# EAGLE design Breadboard Power (EAGLE 7.2.0)
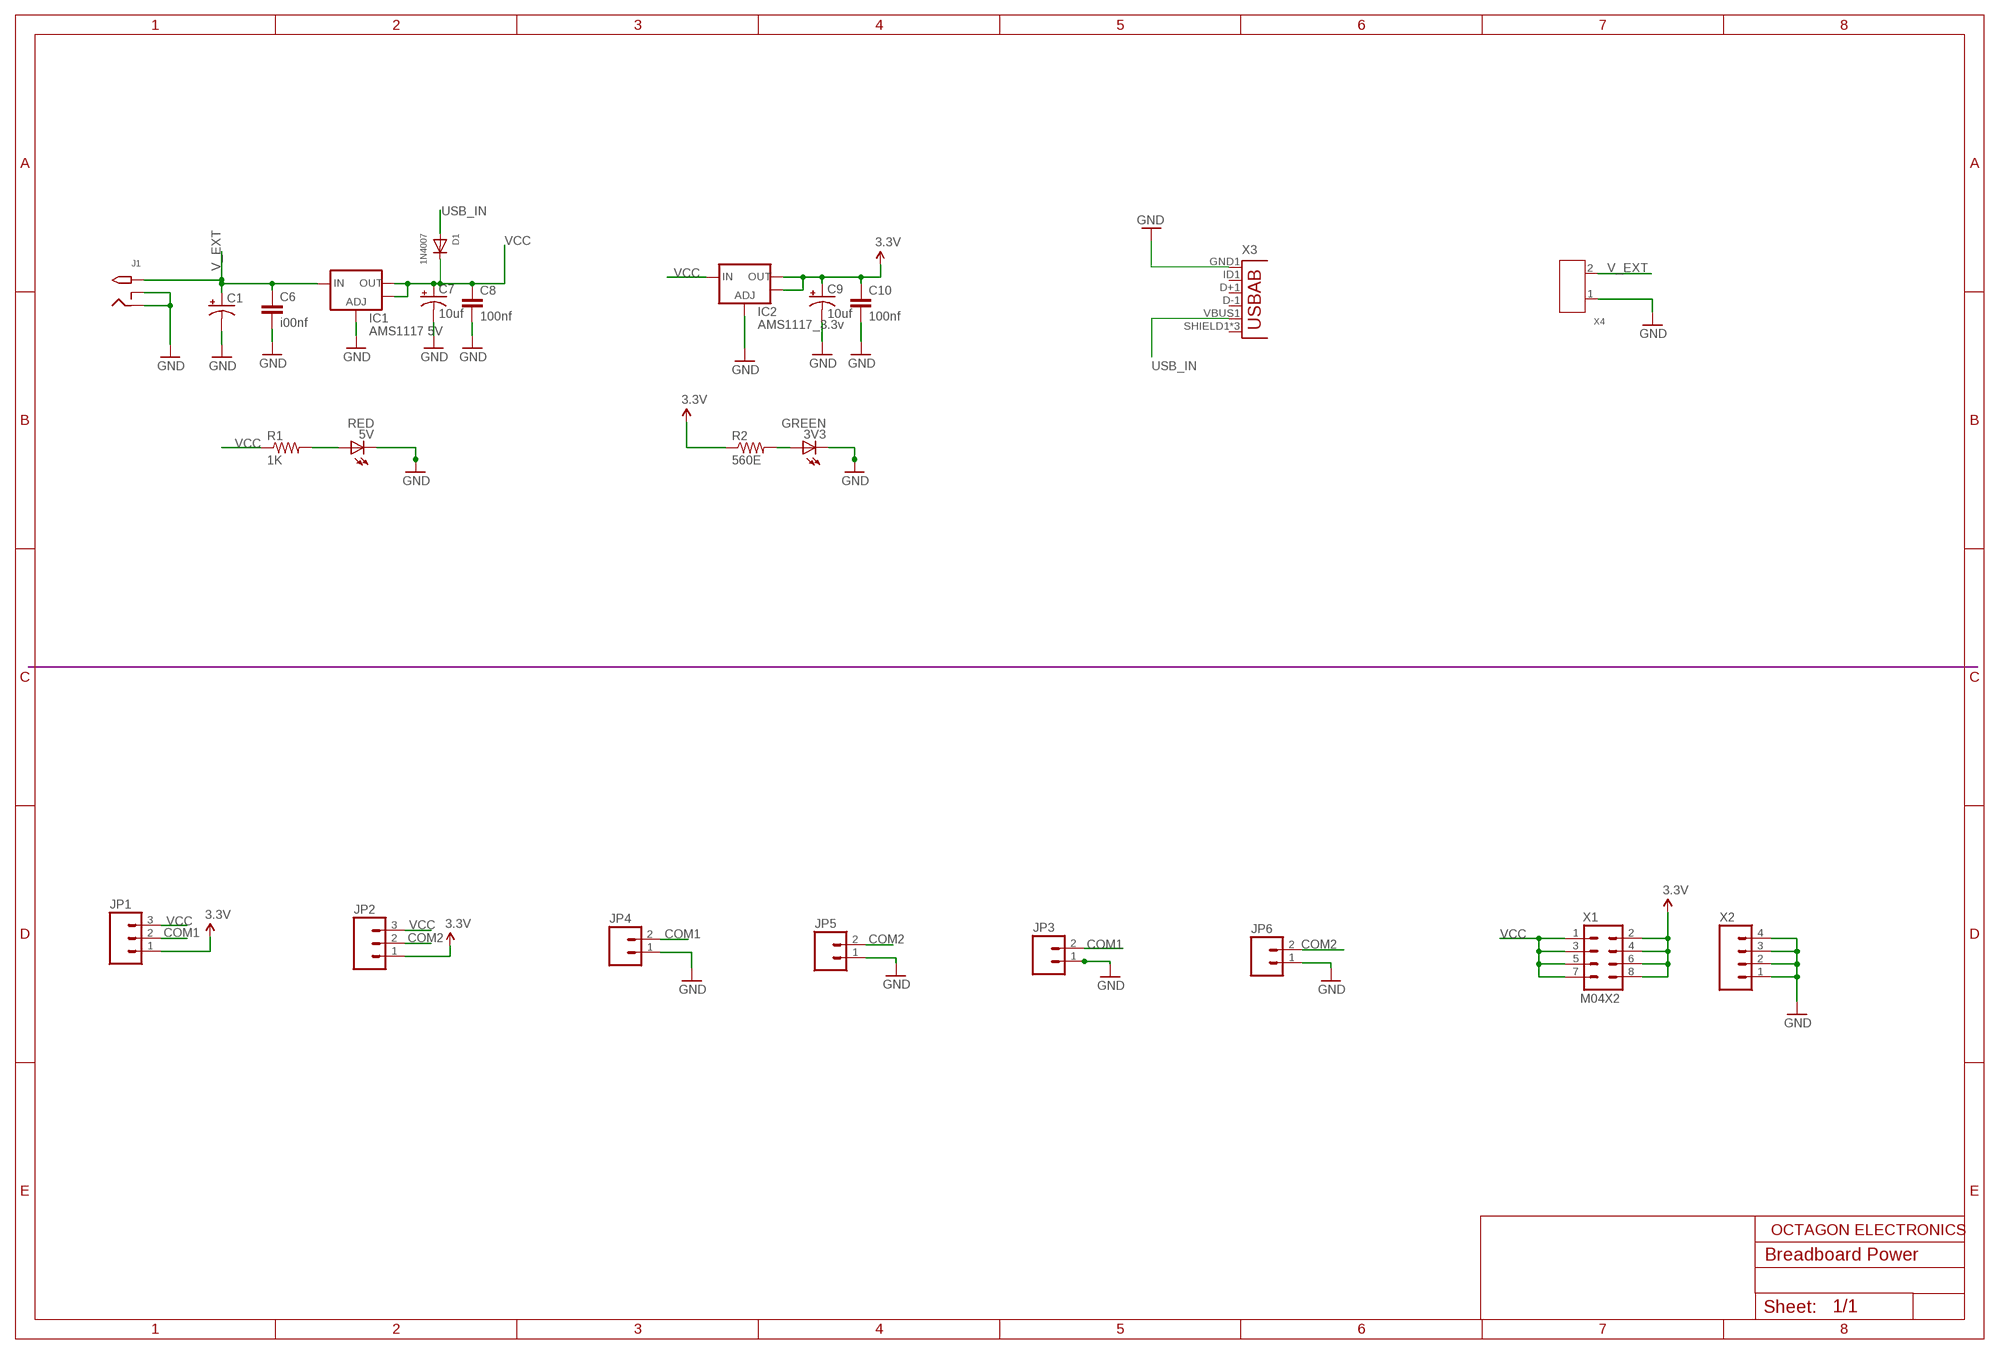
[diagram p0: schematic, sheet 1]

## Parts
3V3  GREEN  LED0603  [LED-0603]
5V  RED  LED0603  [LED-0603]
C1  CAPACITOR_POLARIZEDC  [PANASONIC_C]
C6  i00nf  CAPACITOR-NONPOLARIZEDSMD  [C0603]
C7  10uf  CAPACITOR_POLARIZED1206  [EIA3216]
C8  100nf  CAPACITOR-NONPOLARIZEDSMD  [C0603]
C9  10uf  CAPACITOR_POLARIZED1206  [EIA3216]
C10  100nf  CAPACITOR-NONPOLARIZEDSMD  [C0603]
D1  1N4007  DIODESMA  [SMADIODE]
IC1  AMS1117 5V  V_REG_LM1117SOT223  [SOT223]
IC2  AMS1117_3.3v  V_REG_LM1117SOT223  [SOT223]
J1  2.1MMJACKTHM  [PJ-102A]
JP1  M03PTH  [1X03]
JP2  M03PTH  [1X03]
JP3  M02PTH  [1X02]
JP4  M02PTH  [1X02]
JP5  M02PTH  [1X02]
JP6  M02PTH  [1X02]
R1  1K  R-US_R0603  [R0603]
R2  560E  R-US_R0603  [R0603]
X1  M04X2  [2X4]
X2  M04PTH  [1X04]
X3  USB-ABCONN-11794  [USB-AB-MICRO-SMD_V03]
X4  SCREW-TERMINAL-GREEN(2P-5.0)  [H2-5.0-10.5X8.0MM]

## Nets
3.3V: C9.A(+) C10.1 IC2.2(OUT) IC2.4(OUT) JP1.1 JP2.1 R2.1 X1.2 X1.4 X1.6 X1.8
COM1: JP1.2 JP3.2 JP4.2
COM2: JP2.2 JP5.2 JP6.2
GND: 3V3.C 5V.C C1.- C6.2 C7.C(-) C8.2 C9.C(-) C10.2 IC1.1(ADJ) IC2.1(ADJ) J1.RING J1.RING_SW JP3.1 JP4.1 JP5.1 JP6.1 X2.1 X2.2 X2.3 X2.4 X3.GND1(GND) X4.1
N$1: 5V.A R1.2
N$5: 3V3.A R2.2
USB_IN: D1.A X3.VBUS1(VBUS)
V_EXT: C1.+ C6.1 IC1.3(IN) J1.TIP X4.2
VCC: C7.A(+) C8.1 D1.C IC1.2(OUT) IC1.4(OUT) IC2.3(IN) JP1.3 JP2.3 R1.1 X1.1 X1.3 X1.5 X1.7
Unconnected: X3.D+1(D+) X3.D-1(D-) X3.ID1(USBID) X3.SHIELD1(SHIELD) X3.SHIELD2(SHIELD) X3.SHIELD3(SHIELD)

## Notes on the sheet
- OCTAGON ELECTRONICS

## Library data of the parts
3V3 5V = Entesla_Kanni:LED: LEDs Standard schematic elements and footprints for 5mm, 3mm, 1206, and 0603 sized LEDs. 5mm - Spark Fun Electronics SKU : COM-00529 (and others)
C1 C7 C9 = Entesla_Kanni:CAPACITOR_POLARIZED: Capacitor Polarized These are commonly used SMD and PTH capacitors. Verify the external diameter of the through hole, as it may vary with manufacturer.
C6 C8 C10 = Entesla_Kanni:CAPACITOR-NONPOLARIZED: CAPACITOR, European symbol,Non Polarized Capacitors
D1 = usb:DIODE: Diode SMADIODE - SMA Surface Mount Package 20V 1A Schottky Diode Digikey: 641-1014-6-ND DO-1N4148 - Through Hole Small Current Diode SOD-123 20V 1 A (.5mV Vf) Schottky Diode - Digikey: MBRX120TPMSCT-ND SOD-323 10V 570mA (.38mV Vf, 3ns) Schottky Diode - Digikey: ZLLS410CT-ND SOD-523 30V 30mA Schottky Diode (RB751S-40TE61) - Digikey: RB751S-40TE61CT-ND SOT23-R/W - SOT23 Package (R = Solder Paste/Reflow Ovens, W = Hand-Soldering) BAT54Film 40V 300mA - Digikey: 497-7162-1-ND
IC1 IC2 = SparkFun-PowerIC:V_REG_LM1117: Voltage Regulator LM1117 Standard adjustable voltage regulator but in SMD form. Spark Fun Electronics SKU : COM-00595; PROD_ID: VREG-08170
J1 = adafruit:2.1MMJACK: 2.1mm x 5.5mm THM DC jack with internal switch. Digikey part #PJ-102A, 4UCON part #05537 2.1mm x 5.5mm SMT DC jack with internal switch. Digikey part #PJ-002A-SMT, 4UCON part #03267 By microbuilder.eu & adafruit.com
JP1 JP2 = Entesla-lib-Aug2010:M03: Header 3 Standard 3-pin 0.1" header. Use with straight break away headers (SKU : PRT-00116), right angle break away headers (PRT-00553), swiss pins (PRT-00743), machine pins (PRT-00117), and female headers (PRT-00115). Molex polarized connector foot print use with SKU : PRT-08232 with associated crimp pins and housings.
JP3-JP6 = led_0603:M02: Header 2 Standard 2-pin 0.1" header. Use with straight break away headers (SKU : PRT-00116), right angle break away headers (PRT-00553), swiss pins (PRT-00743), machine pins (PRT-00117), and female headers (PRT-00115). Molex polarized connector foot print use with SKU : PRT-08233 with associated crimp pins and housings.
R1 R2 = Entesla_Kanni:R-US_: RESISTOR, American symbol
X1 = SparkFun-Connectors:M04X2: .1" header, two rows of four.
X2 = usb:M04: Header 4 Standard 4-pin 0.1" header. Use with straight break away headers (SKU : PRT-00116), right angle break away headers (PRT-00553), swiss pins (PRT-00743), machine pins (PRT-00117), and female headers (PRT-00115). Molex polarized connector foot print use with SKU : PRT-08231 with associated crimp pins and housings.
X3 = SparkFun-Connectors:USB-AB: This is a USB AB connector that is compatible with USB OTG. i.e. this connector can serve as a host or device; PROD_ID: CONN-11794
X4 = Seeed-OPL-Connector:SCREW-TERMINAL-GREEN(2P-5.0): 320110031

## Net classes
0 default: width 0.003 mm, drill 0.254 mm, clearance 0.152 mm

## Board
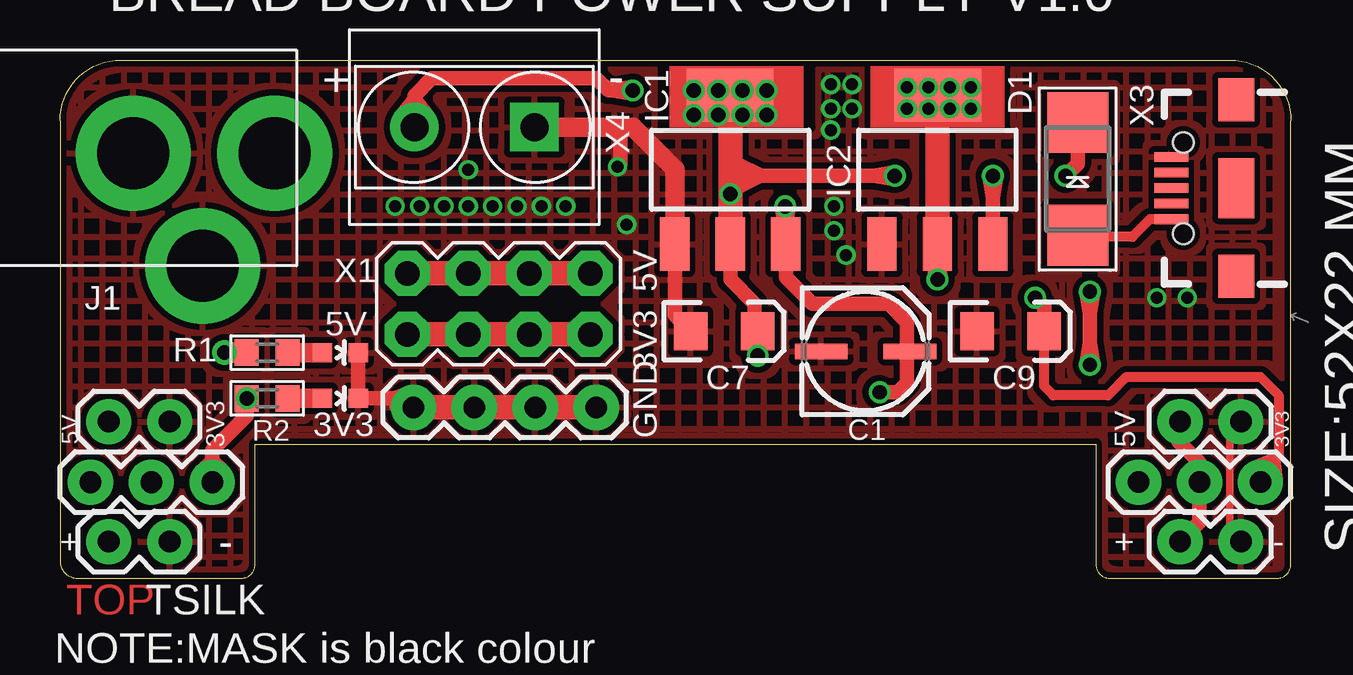
[diagram p1: board, top side]
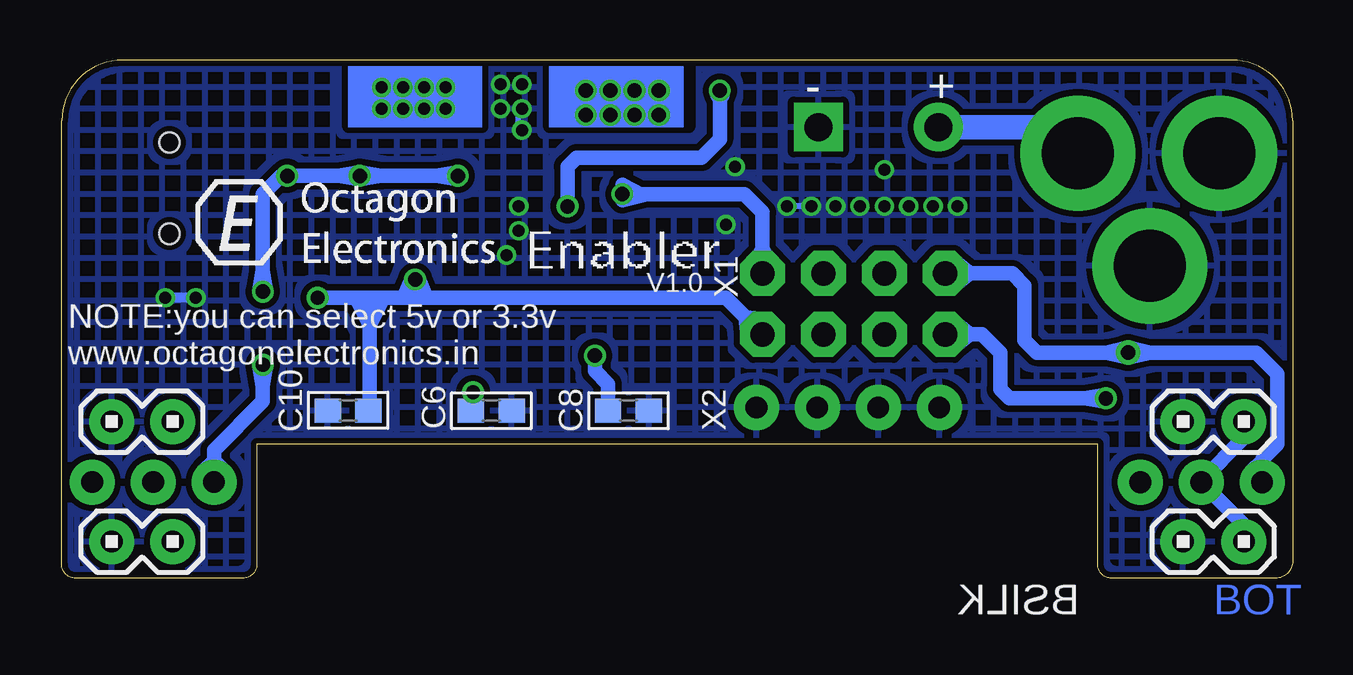
[diagram p2: board, bottom side, seen from below]

Size 51.31 x 21.59 mm. Coordinates in mm from the lower left corner, seen from the top.
Outline: 0,19.05 0,0.72 arc90 0.72,0 7.56,0 arc90 8.13,0.57 8.13,5.59 43.18,5.59 43.18,0.57 arc90 43.75,0 50.74,0 arc90 51.31,0.57 51.31,19.05 arc90 48.77,21.59 2.54,21.59 arc90 0,19.05
Copper layers (1*16): Top 0.035mm / dielectric 1.5mm / Bottom 0.035mm
Design rules "SeeedStudio_rule_no_angle_090911 *": minimum track width 6mil, minimum drill 12mil, track to track 6mil, track to pad 6mil, pad to pad 6mil, via to via 6mil, smd to smd 0mil, copper to edge 10mil, drill to drill 10mil, minimum pad ring 10mil, minimum via ring 6mil, stop-mask expansion 2mil, vias tented up to drill 100mil, thermal gap 10mil
tRestrict: area 25.1,18.8 to 31.2,21.3; area 34.5,19 to 38.9,21.3
bRestrict: area 25.1,18.8 to 31,21.3; area 34.5,19 to 38.6,21.3

### Footprints (pad centres in the part's own frame; a part is rotated, then mirrored left to right if it is on the bottom)
LED-0603 = smd 0.8 x 0.8: A 0,-0.75; C 0,0.75
PANASONIC_C = smd 2.2 x 0.65: + 1.9,-0.2; - -1.8,-0.2
C0603 = smd 1.1 x 1: 1 -0.85,0; 2 0.85,0
EIA3216 = smd 1.4 x 1.6: A 1.4,0; C -1.4,0
SMADIODE = smd 2.54 x 2.54: A 2.349,0; C -2.349,0
SOT223 = smd 1.219 x 2.235: 1 -2.311,-3.099; 2 0,-3.099; 3 2.311,-3.099 | smd 3.6 x 2.2: 4 0,3.099
PJ-102A = drill 3 pad 4.8: RING 0.1,-3.39; RING_SW -4.6,-6.29; TIP 0.1,-9.29
1X03 = drill 0.9 pad 1.88: 1 0,0; 2 2.54,0; 3 5.08,0
1X02 = drill 0.9 pad 1.88: 1 0,0; 2 2.54,0
R0603 = smd 1 x 1.1: 1 -0.85,0; 2 0.85,0
2X4 = drill 1.016 pad 1.88 octagon: 1 -3.81,-1.27; 2 -3.81,1.27; 3 -1.27,-1.27; 4 -1.27,1.27; 5 1.27,-1.27; 6 1.27,1.27; 7 3.81,-1.27; 8 3.81,1.27
1X04 = drill 0.9 pad 1.88: 1 0,0; 2 2.54,0; 3 5.08,0; 4 7.62,0
USB-AB-MICRO-SMD_V03 = smd 1.4 x 0.4: D+1 2.7,0; D-1 2.7,0.65; GND1 2.7,-1.3; ID1 2.7,-0.65; VBUS1 2.7,1.3 | smd 1.5 x 1.8: SHIELD1 0,3.68; SHIELD3 0,-3.68 | smd 1.5 x 2.5: SHIELD2 0,0 | hole 0.85: 2.2,1.9; 2.2,-1.9
H2-5.0-10.5X8.0MM = drill 1.168 pad 2.032 square: 1 0,2.5 | drill 1.168 pad 2.032: 2 0,-2.5

### Placement (x,y rotation side)
3V3  11.68,7.49 270 top
5V  11.68,9.4 270 top
C1  33.53,9.65 0 top
C6  33.4,6.99 0 bottom
C7  27.69,10.29 0 top
C8  27.69,6.99 0 bottom
C9  39.62,10.29 0 top
C10  39.37,6.99 180 bottom
D1  42.42,16.64 270 top
IC1  27.94,17.02 0 top
IC2  36.58,17.02 0 top
J1  -0.34,17.61 90 top
JP1  6.35,4 180 top
JP2  50.04,4 180 top
JP3  4.57,1.52 180 top
JP4  4.57,6.52 180 top
JP5  49.23,6.52 180 top
JP6  49.23,1.52 180 top
R1  8.64,9.4 0 top
R2  8.64,7.49 0 top
X1  18.29,11.43 180 top
X2  22.35,7.11 180 top
X3  49.02,16.26 180 top
X4  17.27,18.8 270 top

### Tracks (layer width: path | path; a pad name or v marks a point on that pad's centre or on a via)
3.3V  (via drill 0.6)
  Top 0.406: JP2.1 50.04,4.32 50.49,4.78 50.8,5.08 50.8,7.62 50.04,8.38 44.45,8.38 43.69,7.62 41.4,7.62 41.02,8 C9.A
  Top 0.61: IC2.2 36.58,13.35 | 36.58,13.35 v36.58,12.45 | 6.35,4.9 6.35,5.33 7.62,6.61 | 6.35,4.9 JP1.1 | 7.62,6.61 7.79,6.77 R2.1 | 36.58,13.35 36.43,12.47 v36.58,12.45 | 36.58,13.35 36.72,12.47 v36.58,12.45 | 7.62,6.61 7.92,7.44 R2.1 | 7.62,6.61 7.64,7.5 R2.1 | 6.35,4.9 5.9,4.45 JP1.1 | 6.35,4.9 6.8,4.45 JP1.1 | v40.64,11.68 41.02,11.3 C9.A
  Top 0.813: 50.49,4.78 49.83,4.49 JP2.1 50.57,4.05 50.49,4.78
  Top 1.016: IC2.4 IC2.2 | X1.8 X1.6 X1.4 X1.2
  Bottom 0.61: X1.8 13.46,10.16 | 13.46,10.16 12.95,10.16 12.19,9.4 12.19,7.87 11.81,7.49 8.69,7.49 | X1.2 22.82,10.88 | 22.82,10.88 23.62,11.68 36.1,11.68 | 36.1,11.68 36.58,11.68 | 36.58,11.68 37.05,11.68 | 37.05,11.68 38.48,11.68 | 38.48,11.68 v40.64,11.68 | v36.58,12.45 36.58,11.68 | 8.69,7.49 R2.1 | 36.1,11.68 36.69,12.35 v36.58,12.45 | 36.1,11.68 36.44,12.5 v36.58,12.45 | 37.05,11.68 36.71,12.5 v36.58,12.45 | 37.05,11.68 36.47,12.35 v36.58,12.45 | 8.69,7.49 7.81,7.64 R2.1 | 8.69,7.49 7.81,7.35 R2.1 | 13.46,10.16 14.08,9.66 X1.8 | 13.46,10.16 14.08,10.66 X1.8 | 22.82,10.88 22.03,10.79 X1.2 | 22.82,10.88 22.73,10.09 X1.2 | C10.1 38.48,7.02 38.48,10.54 | 38.48,10.54 38.48,11.68 | 38.48,10.54 37.97,11.56 | 38.48,10.54 38.99,11.56
  other vias: 7.79,7.49
COM1
  Bottom 0.254: 3.81,4.06 JP1.2
  Bottom 0.61: JP4.2 2.03,6.1 | 2.03,6.1 2.03,5.84 3.81,4.06 | JP1.2 2.03,2.22 2.03,2.03 | 2.03,2.03 JP3.2 | 2.03,6.1 1.65,6.73 | 2.03,6.1 2.41,6.86 | 2.03,2.03 1.65,1.4 | 2.03,2.03 2.54,1.27
COM2
  Top 0.61: JP5.2 46.61,6.45 46.61,5.71 47.5,4.83 JP2.2 47.5,2.34 JP6.2
GND  (via drill 0.5)
  Top 0.305: JP6.1 48.77,1.98 48.77,6.07 JP5.1
  Top 0.61: IC1.1 25.65,13.39 | 5V.C 3V3.C 13.92,7.49 | IC2.1 34.29,13.51 | 25.63,13.97 25.63,10.94 C7.C | C9.C 37.97,10.28 | X2.4 14.35,7.49 13.92,7.49 | 13.92,7.49 14.14,6.89 X2.4 | 13.92,7.49 14.52,7.71 X2.4 | 19.56,19.3 20.83,18.8 19.56,18.29 | v23.24,17.14 23.37,17.27 23.37,18.8
  Top 0.813: X4.1 20.83,18.8 23.37,18.8 23.88,18.8 25.63,17.04 25.63,13.97 IC1.1 | X2.1 22.48,6.99
  Top 1.016: X2.4 X2.3 X2.2 X2.1
  Bottom 0.254: v20.07,15.49 v21.08,15.49 | v32.13,18.67 32.26,18.8 32.26,19.56 v32.13,19.56 32,19.56
  Bottom 0.406: v45.72,11.68 v46.99,11.68
  other vias: 17.02,17.02 13.97,15.49 14.99,15.49 16,15.49 17.02,15.49 18.03,15.49 19.05,15.49 23.62,14.73 33.02,20.57 33.02,19.56 32.26,15.49 32.26,14.48 32.77,13.46 32.13,20.57
  pour Top (isolate 0.254, hatched): 0,0 0,21.59 51.56,21.59 51.31,0 43.18,0 43.18,5.59 8.13,5.59 8.13,0
  pour Bottom (isolate 0.254, hatched): 8.13,0 0.25,0 arc-90 0,0.25 0,21.59 51.56,21.59 51.31,0 43.18,0 43.18,5.59 8.13,5.59
N$1
  Top 0.813: R1.2 5V.A
N$2  (via drill 0.6)
  other vias: 26.42,20.32
N$3  (via drill 0.6)
  other vias: 27.43,20.32
N$4  (via drill 0.6)
  other vias: 28.45,20.32
N$5
  Top 0.813: R2.2 3V3.A
N$6  (via drill 0.6)
  other vias: 29.46,20.32
N$9  (via drill 0.6)
  other vias: 29.46,19.3
N$10  (via drill 0.6)
  other vias: 28.45,19.3
N$11  (via drill 0.6)
  other vias: 27.43,19.3
N$12  (via drill 0.6)
  other vias: 26.42,19.3
N$15  (via drill 0.5)
  other vias: 35.31,20.45
N$16  (via drill 0.5)
  other vias: 35.31,19.56
N$17  (via drill 0.5)
  other vias: 36.2,20.45
N$18  (via drill 0.5)
  other vias: 37.08,20.45
N$19  (via drill 0.5)
  other vias: 37.97,20.45
N$20  (via drill 0.5)
  other vias: 37.97,19.56
N$21  (via drill 0.5)
  other vias: 37.08,19.56
N$22  (via drill 0.5)
  other vias: 36.2,19.56
N$23
  Top 0.61: 46.48,6.1 46.23,6.73
N$24
  Top 0.61: 46.74,5.84 47.12,6.48 46.86,7.11 46.35,6.86
N$25
  Top 0.61: 46.23,1.65 46.99,1.78 46.74,1.14
N$26
  Bottom 1.016: 8.13,18.54 10.16,19.05 9.65,16.76
USB_IN
  Top 0.406: X3.VBUS1 45.44,14.96 44.7,14.22 42.48,14.22 D1.A
V_EXT  (via drill 0.6)
  Top 0.61: 22.98,20.32 22.86,20.32 22.35,20.83 15.49,20.83 14.77,20.11 14.77,19.96 | 22.98,20.32 v23.88,20.32 | v30.23,15.49 30.25,15.47 30.25,14.59 | 30.25,14.59 IC1.3 30.25,12.55 31.37,11.43 34.54,11.43 35.31,10.67 35.31,9.57 C1.+ 35.31,9.33 35.31,8.13 34.92,7.75 v34.16,7.75 | 14.77,19.96 X4.2 | 22.98,20.32 23.85,20.17 v23.88,20.32 | 22.98,20.32 23.85,20.47 v23.88,20.32 | 30.25,14.59 30.37,15.47 v30.23,15.49 | 30.25,14.59 30.08,15.47 v30.23,15.49 | 14.77,19.96 14.21,19.23 X4.2 | 14.77,19.96 15.34,19.23 X4.2
  Bottom 0.61: v30.23,15.49 30.23,17.14 29.84,17.53 24.64,17.53 23.88,18.29 23.88,20.15 | 23.9,20.47 v23.88,20.32 23.9,20.17 | v30.23,15.49 30.08,15.52 | v30.23,15.49 30.37,15.52 | C6.1 34.16,7.07 v34.16,7.75
  Bottom 0.813: 23.9,20.17 23.88,20.15
  Bottom 1.016: J1.TIP 10.04,18.8 X4.2
VCC  (via drill 0.6, 0.6 pad 1.02)
  Top 0.61: 27.94,16.76 28.42,16.76 | 28.42,16.76 29.21,16.76 | 29.21,16.76 33.9,16.76 | 33.9,16.76 v34.8,16.76 | R1.1 7.76,9.4 | 7.76,9.4 v6.86,9.4 | v42.93,11.94 42.93,11.04 | 42.93,11.04 42.93,9.79 | 42.93,9.79 v42.93,8.89 | 27.94,13.97 27.94,12.45 28.96,11.43 28.96,10.42 C7.A v29.08,9.27 | v38.89,16.76 38.86,16.76 38.89,16.74 38.89,15.86 | 38.89,15.86 IC2.3 | 7.76,9.4 6.9,9.6 v6.86,9.4 | 7.76,9.4 6.9,9.2 v6.86,9.4 | 28.42,16.76 27.83,16.1 | 28.42,16.76 28.08,15.95 v27.94,16 | 33.9,16.76 34.77,16.62 v34.8,16.76 | 33.9,16.76 34.77,16.91 v34.8,16.76 | 38.89,15.86 39.03,16.74 v38.89,16.76 | 38.89,15.86 38.74,16.74 v38.89,16.76 | 42.93,11.04 43.07,11.91 v42.93,11.94 | 42.93,11.04 42.78,11.91 v42.93,11.94 | 42.93,9.79 42.78,8.91 v42.93,8.89 | 42.93,9.79 43.07,8.91 v42.93,8.89 | 29.21,16.76 28.19,17.27 | 29.21,16.76 27.94,16.13 | D1.C 42.42,17.27 v41.91,16.76
  Top 1.016: IC1.4 27.94,16.76 27.94,16.13 v27.94,16 27.94,13.97 IC1.2 | X1.7 X1.5 X1.3 X1.1
  Bottom 0.61: X1.7 13.46,12.7 | 13.46,12.7 11.68,12.7 11.18,12.19 11.18,9.91 10.67,9.4 7.76,9.4 | v34.8,16.76 35.7,16.76 | 35.7,16.76 37.99,16.76 | 37.99,16.76 v38.89,16.76 | 39.79,16.76 41.66,16.76 v41.91,16.76 42.16,16.76 42.93,16 42.93,12.84 | 39.79,16.76 v38.89,16.76 | 1.27,4.9 1.27,4.95 0.64,5.59 0.64,8.51 1.52,9.4 5.96,9.4 | 1.27,4.9 JP1.3 | 7.76,9.4 v6.86,9.4 | 5.96,9.4 v6.86,9.4 | v42.93,11.94 42.93,12.84 | v42.93,8.89 42.93,7.99 | 42.93,7.99 42.93,7.37 44.96,5.33 44.96,4.9 | 44.96,4.9 JP2.3 | 7.76,9.4 6.9,9.6 v6.86,9.4 | 7.76,9.4 6.9,9.2 v6.86,9.4 | 5.96,9.4 6.81,9.2 v6.86,9.4 | 5.96,9.4 6.81,9.6 v6.86,9.4 | 35.7,16.76 34.82,16.91 v34.8,16.76 | 35.7,16.76 34.82,16.62 v34.8,16.76 | 37.99,16.76 38.86,16.62 v38.89,16.76 | 37.99,16.76 38.86,16.91 v38.89,16.76 | 39.79,16.76 38.91,16.91 v38.89,16.76 | 39.79,16.76 38.91,16.62 v38.89,16.76 | 42.93,12.84 42.78,11.96 v42.93,11.94 | 42.93,12.84 43.07,11.96 v42.93,11.94 | 42.93,7.99 43.07,8.87 v42.93,8.89 | 42.93,7.99 42.78,8.87 v42.93,8.89 | JP1.3 0.82,4.45 | 1.27,4.9 1.72,4.45 JP1.3 | 44.96,4.9 44.51,4.45 JP2.3 | 44.96,4.9 45.41,4.45 JP2.3 | 13.46,12.7 14.08,12.2 X1.7 | 13.46,12.7 14.08,13.2 X1.7 | X1.1 22.1,13.72 | 22.1,13.72 22.1,15.24 22.86,16 26.92,16 | 26.92,16 27.18,16 | 27.18,16 v27.94,16 | v29.08,9.27 29.08,8.64 28.54,8.09 C8.1 | 27.18,16 27.94,16.38 | 26.92,16 27.94,15.75 | 22.1,13.72 21.59,12.7 | 22.1,13.72 22.61,12.7
(copper drawn outside any net)
  shapes: Bottom area x2, Top area x2

### Text on the board
Top: TOP
Bottom: BOT
tPlace: BREAD BOARD POWER SUPPLY V1.0 | + | + | - | 5V | J1 | 3V3 | 5V | GND | 3V3 | 5V | 3V3 | + | - | + | - | SIZE:52X22 MM | TSILK | NOTE:MASK is black colour
bPlace: + | - | X1 | V1.0 | NOTE:you can select 5v or 3.3v | www.octagonelectronics.in | BSILK
tStop: OCT00001 | TSTOP | OCT00001
bStop: OCT00001 | BSTOP
Reference: J1